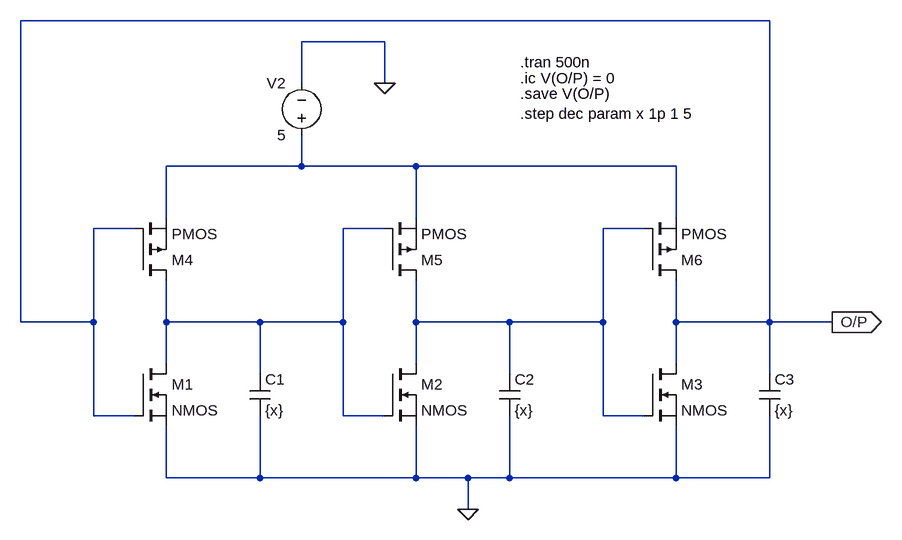
[diagram p0: schematic Circuit1-V2.asc]
Circuit1-V2.asc, the LTspice schematic file:
Version 4
SHEET 1 1312 680
WIRE 816 -320 -336 -320
WIRE 224 -288 96 -288
WIRE 96 -224 96 -288
WIRE 224 -224 224 -288
WIRE 96 -96 96 -144
WIRE 96 -96 -112 -96
WIRE 272 -96 96 -96
WIRE 672 -96 272 -96
WIRE -112 -16 -112 -96
WIRE 272 -16 272 -96
WIRE 672 -16 672 -96
WIRE -160 0 -224 0
WIRE 224 0 160 0
WIRE 624 0 560 0
WIRE -336 144 -336 -320
WIRE -224 144 -224 0
WIRE -224 144 -336 144
WIRE -112 144 -112 80
WIRE 32 144 -112 144
WIRE 160 144 160 0
WIRE 160 144 32 144
WIRE 272 144 272 80
WIRE 416 144 272 144
WIRE 560 144 560 0
WIRE 560 144 416 144
WIRE 672 144 672 80
WIRE 816 144 816 -320
WIRE 816 144 672 144
WIRE 912 144 816 144
WIRE -112 208 -112 144
WIRE 272 208 272 144
WIRE 672 208 672 144
WIRE 32 224 32 144
WIRE 416 224 416 144
WIRE 816 224 816 144
WIRE -224 288 -224 144
WIRE -160 288 -224 288
WIRE 160 288 160 144
WIRE 224 288 160 288
WIRE 560 288 560 144
WIRE 624 288 560 288
WIRE -112 384 -112 304
WIRE 32 384 32 288
WIRE 32 384 -112 384
WIRE 272 384 272 304
WIRE 272 384 32 384
WIRE 352 384 272 384
WIRE 416 384 416 288
WIRE 416 384 352 384
WIRE 672 384 672 304
WIRE 672 384 416 384
WIRE 816 384 816 288
WIRE 816 384 672 384
WIRE 352 432 352 384
FLAG 352 432 0
FLAG 224 -224 0
FLAG 912 144 O/P
IOPIN 912 144 Out
SYMBOL nmos -160 208 R0
SYMATTR InstName M1
SYMBOL nmos 224 208 R0
SYMATTR InstName M2
SYMBOL nmos 624 208 R0
SYMATTR InstName M3
SYMBOL pmos -160 80 M180
SYMATTR InstName M4
SYMBOL pmos 224 80 M180
SYMATTR InstName M5
SYMBOL pmos 624 80 M180
SYMATTR InstName M6
SYMBOL cap 16 224 R0
SYMATTR InstName C1
SYMATTR Value {x}
SYMBOL cap 400 224 R0
SYMATTR InstName C2
SYMATTR Value {x}
SYMBOL voltage 96 -128 R180
WINDOW 0 24 96 Left 2
WINDOW 3 24 16 Left 2
WINDOW 123 0 0 Left 0
WINDOW 39 0 0 Left 0
SYMATTR InstName V2
SYMATTR Value 5
SYMBOL cap 800 224 R0
SYMATTR InstName C3
SYMATTR Value {x}
TEXT 432 -256 Left 2 !.tran 500n
TEXT 432 -232 Left 2 !.ic V(O/P) = 0
TEXT 432 -208 Left 2 !.save V(O/P)\n.step dec param x 1p 1 5

The netlist it stands for:
* Circuit1-V2.asc
M1 N002 O/P 0 0 NMOS
M2 N003 N002 0 0 NMOS
M3 O/P N003 0 0 NMOS
M4 N002 O/P N001 N001 PMOS
M5 N003 N002 N001 N001 PMOS
M6 O/P N003 N001 N001 PMOS
C1 N002 0 {x}
C2 N003 0 {x}
V2 N001 0 5
C3 O/P 0 {x}
.model NMOS NMOS
.model PMOS PMOS
.lib standard.mos
.tran 500n
.ic V(O/P) = 0
.save V(O/P)
.step dec param x 1p 1 5
.backanno
.end